# Altium project STM32F103C8T6.PrjPcb
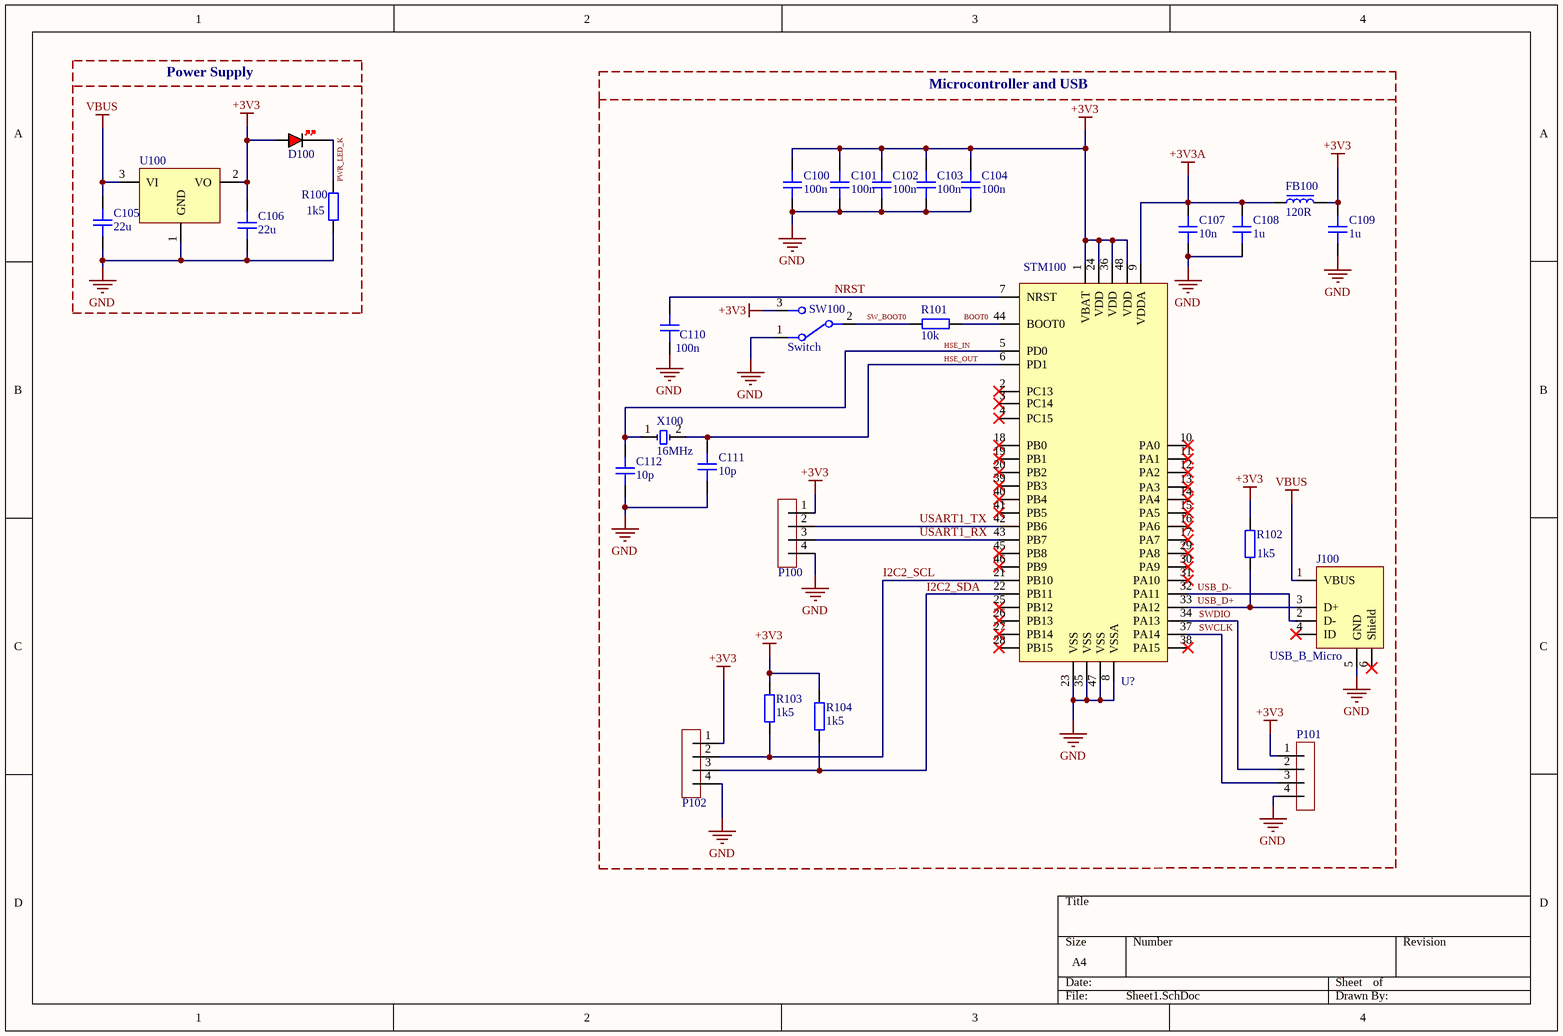
[diagram p0: Sheet1.SchDoc]
1 sheet, 28 parts. Net scope: global (net labels, ports and power ports of the same name join across sheets).
Board file: PCB1.PcbDoc

## Sheet Sheet1.SchDoc
size A4; SheetNumber: 1; SheetTotal: 1

### Parts
C100  100n  [CAP_0603]
C101  100n  [CAP_0603]
C102  100n  [CAP_0603]
C103  100n  [CAP_0603]
C104  100n  [CAP_0603]
C105  22u  [CAP_0603]
C106  22u  [CAP_0603]
C107  10n  [CAP_0603]
C108  1u  [CAP_0603]
C109  1u  [CAP_0603]
C110  100n  [CAP_0603]
C111  10p  [CAP_0603]
C112  10p  [CAP_0603]
D100  RED  [LED_0603_RED]  (value not drawn)
FB100  120R  [FB_0603]
J100  USB_B_Micro  [USB_B_MICRO]
P100  Terminal_Block_Header_1  [HEADER_4]  (value not drawn)
P101  Terminal_Block_Header_1  [HEADER_4]  (value not drawn)
P102  Terminal_Block_Header_1  [HEADER_4]  (value not drawn)
R100  1k5  [RES_0603]
R101  10k  [RES_0603]
R102  1k5  [RES_0603]
R103  1k5  [RES_0603]
R104  1k5  [RES_0603]
STM100  U?  [STM32F103C8TX]
SW100  Switch  [SWITCH]
U100  Linear Voltage Regulator  [AMS1117]  (value not drawn)
X100  16MHz  [Crystal 8MHZ]

### Blocks framed on the sheet
Power Supply: C105 C106 D100 R100 U100
Microcontroller and USB: C100-C104 C107-C112 FB100 J100 P100-P102 R101-R104 STM100 SW100 X100

### Nets
+3V3: C100.2 C101.2 C102.2 C103.2 C104.2 C106.2 C109.2 D100.A FB100.2 P100.1 P101.1 P102.1 R102.2 R103.2 R104.2 STM100.1(VBAT) STM100.24(VDD) STM100.36(VDD) STM100.48(VDD) SW100.3 U100.2(VO)
+3V3A: C107.2 C108.2 FB100.1 STM100.9(VDDA)
GND: C100.1 C101.1 C102.1 C103.1 C104.1 C105.1 C106.1 C107.1 C108.1 C109.1 C110.1 C111.1 C112.1 J100.5(GND) P100.4 P101.4 P102.4 R100.1 STM100.8(VSSA) STM100.23(VSS) STM100.35(VSS) STM100.47(VSS) SW100.1 U100.1(GND)
VBUS: C105.2 J100.1(VBUS) U100.3(VI)
HSE_IN: C112.2 STM100.5(PD0) X100.1
HSE_OUT: C111.2 STM100.6(PD1) X100.2
I2C2_SCL: P102.2 R103.1 STM100.21(PB10)
I2C2_SDA: P102.3 R104.1 STM100.22(PB11)
NRST: C110.2 STM100.7(NRST)
SWCLK: P101.3 STM100.37(PA14)
SWDIO: P101.2 STM100.34(PA13)
USART1_RX: P100.3 STM100.43(PB7)
USART1_TX: P100.2 STM100.42(PB6)
USB_D+: J100.3(D+) R102.1 STM100.33(PA12)
USB_D-: J100.2(D-) STM100.32(PA11)
NetD100_K: D100.K R100.2
NetR101_1: R101.1 SW100.2(COM)
NetR101_2: R101.2 STM100.44(BOOT0)

Not connected (* = marked no-connect by the designer): J100 4(ID)* 6(Shield)*; STM100 2(PC13)* 3(PC14)* 4(PC15)* 10(PA0)* 11(PA1)* 12(PA2)* 13(PA3)* 14(PA4)* 15(PA5)* 16(PA6)* 17(PA7)* 18(PB0)* 19(PB1)* 20(PB2)* 25(PB12)* 26(PB13)* 27(PB14)* 28(PB15)* 29(PA8)* 30(PA9)* 31(PA10)* 38(PA15)* 39(PB3)* 40(PB4)* 41(PB5)* 45(PB8)* 46(PB9)*

### Notes on the sheet
- 1x 100nF per VDD pin
- VDDA Filtering
- VBUS from USB connector (nom. +5V)  Min. 22uF I/O caps.
- (near X100) CL=2*(CL0 - Cs)= 2*(10-5)pF=10pF
- USB App note AN4879
- Labels drawn without touching a wire or pin: BOOT0, PWR_LED_K, SW_BOOT0

### Library data of the parts
C100-C112 = CAP_0603_10V: Capacitor SMD 0603 10V
D100 = LED_0603_RED: LED 0603 RED SMD
FB100 = FB_0603: Ferrite Bead SMD 0603
P100-P102 = Terminal_Block_Header_1: 4 pin Male
R100-R104 = RES_0603: Resistor SMD 0603
STM100 = STM32F103C8TX: IC MCU 32BIT 64KB FLASH 48LQFP; Manufacturer: STMicroelectronics; Manufacturer Part Number: STM32F103C8T6; Frequency: 72MHz; RAM Size: 20KB; Interface: I2C,SPI,USB,CAN,USART; Number of I/Os: 37; Oscillator Type: Internal; Peripherals: POR,PWM,WDT,DMA,Temp Sensor,I2C; Core Architecture: ARM; Max Power Dissipation: 363mW; Number of Timers/Counters: 3; Number of Programmable I/O: 48; Data Bus Width: 32b; Watchdog Timer: Yes; Max Supply Voltage: 3.6V; Number of ADC Channels: 10; Min Supply Voltage: 2V; Number of Bits: 32; Number of SPI Channels: 2; Number of PWM Channels: 1; Supplier 1: Farnell; RoHS: Yes; Category: Microcontrollers; Stock 1: 19511; Pricing 1: 1=9,00000, 10=8,13000, 25=7,75000, 50=7,60000 (EUR); Case/Package: LQFP; Number of Pins: 48; Weight: 0.006349oz; Min Operating Temperature: -40°C; Max Operating Temperature: 85°C; Packaging: Tray; Memory Type: FLASH; Memory Size: 64KB; Max Frequency: 72MHz; Package Quantity: 1500; Series: STM32F103C8; Density: 64KB; Number of I2C Channels: 2; Termination: SMD/SMT; Address Bus Width: 32b; Length: 7mm; Width: 7mm; Height: 1.4mm; Radiation Hardening: No; Lead Free: Lead Free; Reach SVHC Compliant: Yes; RoHS Compliant: Yes; ComponentLink1URL: https://datasheet.ciiva.com/15122/getdatasheetpartid-69880-15122076.pdf?src-supplier=Verical; ComponentLink1Description: https://datasheet.ciiva.com/15122/getdatasheetpartid-69880-15122076.pdf?src-supplier=Verical; ComponentLink2URL: https://datasheet.ciiva.com/8054/1730126-8054942.pdf?src-supplier=Element14; ComponentLink2Description: https://datasheet.ciiva.com/8054/1730126-8054942.pdf?src-supplier=Element14; ComponentLink3URL: https://datasheet.ciiva.com/14100/pustm-arm-microcont-stm32f103-en-14100508.pdf?src-supplier=Distrelec; ComponentLink3Description: https://datasheet.ciiva.com/14100/pustm-arm-microcont-stm32f103-en-14100508.pdf?src-supplier=Distrelec; ComponentLink4URL: https://datasheet.ciiva.com/16210/cd00161566-16210248.pdf?src-supplier=Future+Electronics; ComponentLink4Description: https://datasheet.ciiva.com/16210/cd00161566-16210248.pdf?src-supplier=Future+Electronics; ComponentLink5URL: https://datasheet.ciiva.com/48687/001075658-da-01-en-mcu-64kb-mem-stm32f103c8t6-lqfp-48-stm-48687589.pdf?src-supplier=Conrad; ComponentLink5Description: https://datasheet.ciiva.com/48687/001075658-da-01-en-mcu-64kb-mem-stm32f103c8t6-lqfp-48-stm-48687589.pdf?src-supplier=Conrad; Supplier Part Number 1: 1447637
U100 = AMS1117: IC-1117 V.REG. 1A 3V3 SOT223 SMD AMS
X100 = Crystal 8MHz: 16MHz SMD Crystal Resonator 10pF ±10ppm ±30ppm -40℃~+85℃ SMD3225-4P Crystals ROHS; Manufacturer: Abracon; Manufacturer Part Number: ABLS-8.000MHZ-B4-T; Load Capacitance: 18pF; Frequency: 8MHz; ESR (Equivalent Series Resistance): 80R; Frequency Stability: 50ppm; Supplier 1: Digi-Key; RoHS: Yes; Category: Crystals; Stock 1: 865; Pricing 1: 1=0,32000, 10=0,26400, 50=0,23760, 100=0,21120, 500=0,20064 (USD); Mount: Surface Mount; Case/Package: SMD/SMT; Min Operating Temperature: -20°C; Max Operating Temperature: 70°C; Frequency Tolerance: 30ppm; Packaging: Tape and Reel; Package Quantity: 1000; Tolerance: 30ppm; Termination: SMD/SMT; Series Resistance: 80R; Length: 11.4mm; Width: 0.185inch; Height: 0.165inch; Depth: 4.7mm; Radiation Hardening: No; REACH SVHC: Yes; Lead Free: Lead Free; ComponentLink1URL: https://datasheet.ciiva.com/854/abls-854117.pdf?src-supplier=Digi-Key; ComponentLink1Description: https://datasheet.ciiva.com/854/abls-854117.pdf?src-supplier=Digi-Key; ComponentLink2URL: https://datasheet.ciiva.com/854/abls-854118.pdf?src-supplier=Digi-Key; ComponentLink2Description: https://datasheet.ciiva.com/854/abls-854118.pdf?src-supplier=Digi-Key; ComponentLink3URL: https://datasheet.ciiva.com/3175/abls-3175446.pdf?src-supplier=Avnet; ComponentLink3Description: https://datasheet.ciiva.com/3175/abls-3175446.pdf?src-supplier=Avnet; ComponentLink4URL: https://datasheet.ciiva.com/854/abls-854119.pdf?src-supplier=Digi-Key; ComponentLink4Description: https://datasheet.ciiva.com/854/abls-854119.pdf?src-supplier=Digi-Key; ComponentLink5URL: https://datasheet.ciiva.com/4944/abls-44621-4944748.pdf?src-supplier=Mouser; ComponentLink5Description: https://datasheet.ciiva.com/4944/abls-44621-4944748.pdf?src-supplier=Mouser; Supplier Part Number 1: 535-10212-1-ND